# Altium schematic sheet PCB_Encoder.SchDoc
size A4; DocumentNumber: 2; SheetNumber: 2; SheetTotal: 8
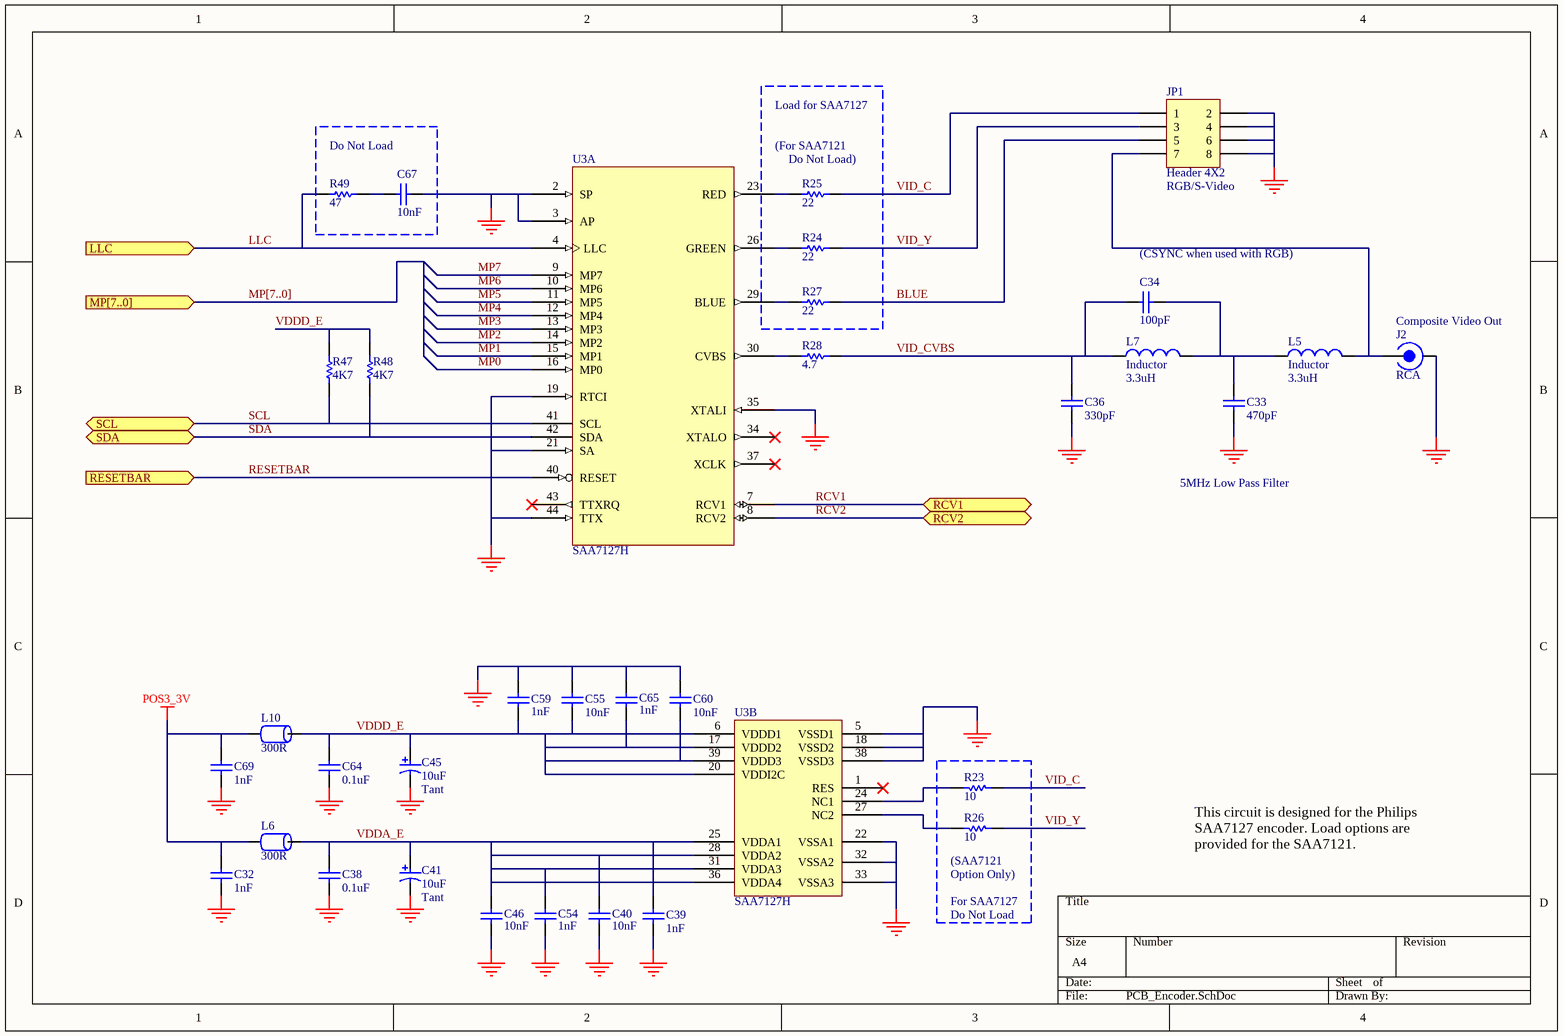
[diagram p0: PCB_Encoder.SchDoc]

## Parts
C32  1nF  [CC2012-0805]
C33  470pF  [CC2012-0805]
C34  100pF  [CC2012-0805]
C36  330pF  [CC2012-0805]
C38  0.1uF  [CC2012-0805]
C39  1nF  [CC2012-0805]
C40  10nF  [CC2012-0805]
C41  10uF  Capacitor Type: Tant  [MCCT-B]
C45  10uF  Capacitor Type: Tant  [MCCT-B]
C46  10nF  [CC2012-0805]
C54  1nF  [CC2012-0805]
C55  10nF  [CC2012-0805]
C59  1nF  [CC2012-0805]
C60  10nF  [CC2012-0805]
C64  0.1uF  [CC2012-0805]
C65  1nF  [CC2012-0805]
C67  10nF  [CC2012-0805]
C69  1nF  [CC2012-0805]
J2  RCA  [RCA_MR551L]
JP1  Header 4X2  [HDR2X4]
L5  Inductor  value 3.3uH  [CC2012-0805]
L6  300R  [CC2012-0805]
L7  Inductor  value 3.3uH  [CC2012-0805]
L10  300R  [CC2012-0805]
R23  10  [CC2012-0805]
R24  22  [CC2012-0805]
R25  22  [CC2012-0805]
R26  10  [CC2012-0805]
R27  22  [CC2012-0805]
R28  4.7  [CC2012-0805]
R47  4K7  [CC2012-0805]
R48  4K7  [CC2012-0805]
R49  47  [CC2012-0805]
U3  SAA7127H  [QFP10X10_44]  (parts A,B of 2)

## Blocks framed on the sheet
Do Not Load: C67 R49

## Ports
LLC (in), MP[7..0] (in), RCV1 (bidir), RCV2 (bidir), RESETBAR (in), SCL (bidir), SDA (bidir)

## Nets
GND: C32.2 C33.2 C36.2 C38.2 C39.2 C40.2 C41.2 C45.2 C46.2 C54.2 C55.1 C59.1 C60.1 C64.2 C65.1 C67.2 C69.2 J2.2 JP1.2 JP1.4 JP1.6 JP1.8 U3.2(SP) U3.3(AP) U3.5(VSSD1) U3.18(VSSD2) U3.19(RTCI) U3.21(SA) U3.22(VSSA1) U3.32(VSSA2) U3.33(VSSA3) U3.35(XTALI) U3.38(VSSD3) U3.44(TTX)
POS3_3V: C32.1 C69.1 L6.1 L10.1
BLUE: JP1.5 R27.2
LLC: R49.1 U3.4(LLC) ; port LLC
MP0: U3.16(MP0)
MP1: U3.15(MP1)
MP2: U3.14(MP2)
MP3: U3.13(MP3)
MP4: U3.12(MP4)
MP5: U3.11(MP5)
MP6: U3.10(MP6)
MP7: U3.9(MP7)
RCV1: U3.7(RCV1) ; port RCV1
RCV2: U3.8(RCV2) ; port RCV2
RESETBAR: U3.40(RESET) ; port RESETBAR
SCL: R47.1 U3.41(SCL) ; port SCL
SDA: R48.1 U3.42(SDA) ; port SDA
VDDA_E: C38.1 C39.1 C40.1 C41.1 C46.1 C54.1 L6.2 U3.25(VDDA1) U3.28(VDDA2) U3.31(VDDA3) U3.36(VDDA4)
VDDD_E: C45.1 C55.2 C59.2 C60.2 C64.1 C65.2 L10.2 R47.2 R48.2 U3.6(VDDD1) U3.17(VDDD2) U3.20(VDDI2C) U3.39(VDDD3)
VID_C: JP1.1 R23.2 R25.2
VID_CVBS: C34.1 C36.1 L7.1 R28.2
VID_Y: JP1.3 R24.2 R26.2
NetC33_1: C33.1 C34.2 L5.1 L7.2
NetC67_1: C67.1 R49.2
NetJ2_1: J2.1 JP1.7 L5.2
NetR23_1: R23.1 U3.24(NC1)
NetR24_1: R24.1 U3.26(GREEN)
NetR25_1: R25.1 U3.23(RED)
NetR26_1: R26.1 U3.27(NC2)
NetR27_1: R27.1 U3.29(BLUE)
NetR28_1: R28.1 U3.30(CVBS)

Not connected (* = marked no-connect by the designer): U3 1(RES)* 34(XTALO)* 37(XCLK)* 43(TTXRQ)*

## Buses and harness runs
bus MP[7..0] = port MP[7..0]

## Notes on the sheet
- Load for SAA7127
- (For SAA7121
- (near R25) Do Not Load)
- (near JP1) RGB/S-Video
- (near C34) (CSYNC when used with RGB)
- (near J2) Composite Video Out
- 5MHz Low Pass Filter
- (near R26) (SAA7121
- (near R26) Option Only)
- For SAA7127
- Do Not Load
- This circuit is designed for the Philips SAA7127 encoder. Load options are provided for the SAA7121.

## Library data of the parts
C32-C34 C36 C38-C40 C46 C54 C55 C59 C60 C64 C65 C67 C69 = CAP: Capacitor; Fitted: True
C41 C45 = CAP_POLAR: Polar Capacitor; Fitted: True
J2 = RCA: RCA Socket
JP1 = Header 4X2: Header, 4-Pin, Dual row; Manufacturer: Generic Components; Class I: Connector; Revision: July-2002: Re-released for DXP Platform.; Publisher: Altium Limited
L5 L7 = Inductor: Manufacturer: Generic Components; Class I: Passive; Published: 8-Jun-2000; Revision: July-2002: Re-released for DXP Platform.; Publisher: Altium Limited; Class II: Inductor
L6 L10 = FERRITE_BEAD: BMB Series Ferrite Chip Bead
R23-R28 R47-R49 = RES: Resistor; Fitted: True
U3 = SAA7127H: Philips Digital Video Encoder